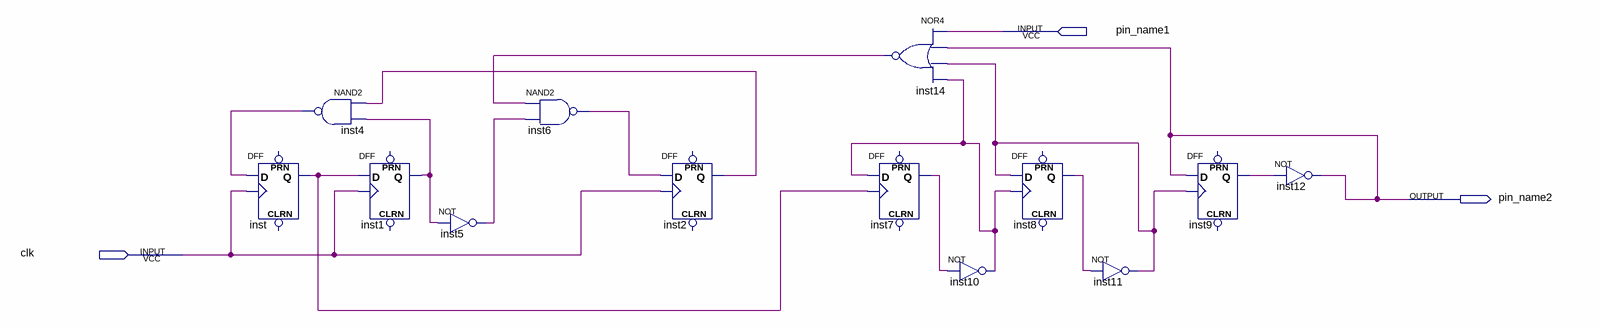
[diagram p0: schematic sheet]
// Quartus schematic cicuito1.bdf as structural Verilog: 13 symbols, 3 pins
module cicuito1 (
  input  pin_name1,
  input  clk,
  output pin_name2
);

  wire inst1_q, inst2_q, inst4_out, inst5_out, inst6_out, inst7_q, inst8_q, inst9_q, inst10_out, inst11_out,
       inst14_out, inst_q;

  DFF inst (.CLK(clk), .D(inst4_out), .Q(inst_q));  // open: CLRN, PRN
  nand inst4 (inst4_out, inst2_q, inst1_q);
  DFF inst1 (.CLK(clk), .D(inst_q), .Q(inst1_q));  // open: CLRN, PRN
  not inst5 (inst5_out, inst1_q);
  nand inst6 (inst6_out, inst14_out, inst5_out);
  DFF inst2 (.CLK(clk), .D(inst6_out), .Q(inst2_q));  // open: CLRN, PRN
  DFF inst7 (.CLK(inst_q), .D(inst10_out), .Q(inst7_q));  // open: CLRN, PRN
  nor inst14 (inst14_out, pin_name1, pin_name2, inst11_out, inst10_out);
  not inst10 (inst10_out, inst7_q);
  DFF inst8 (.CLK(inst10_out), .D(inst11_out), .Q(inst8_q));  // open: CLRN, PRN
  not inst11 (inst11_out, inst8_q);
  DFF inst9 (.CLK(inst11_out), .D(pin_name2), .Q(inst9_q));  // open: CLRN, PRN
  not inst12 (pin_name2, inst9_q);
endmodule
